# EAGLE design perfboard (EAGLE 7.3.0)
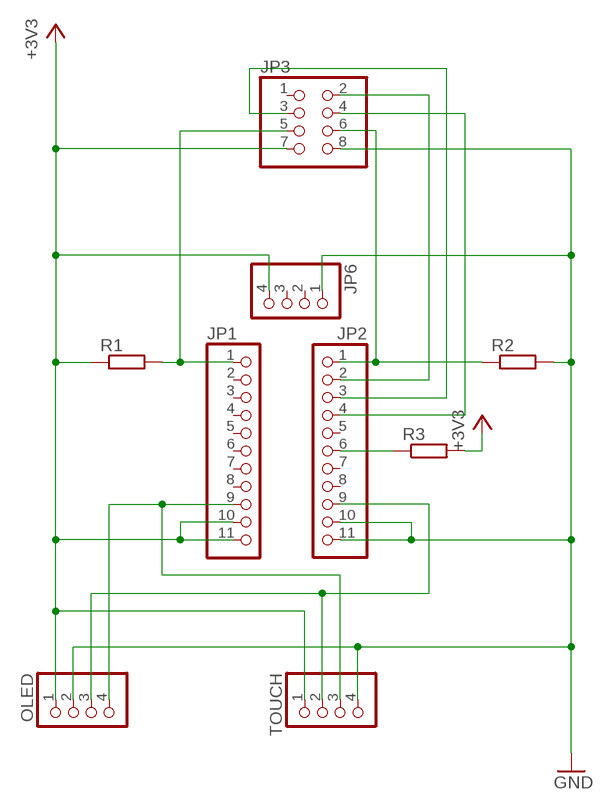
[diagram p0: schematic, sheet 1]

## Parts
JP1  PINHD-1X11  [1X11]
JP2  PINHD-1X11  [1X11]
JP3  PINHD-2X4  [2X04]
JP6  PINHD-1X4  [1X04]
OLED  PINHD-1X4  [1X04]
R1  R-EU_0207/7  [0207/7]
R2  R-EU_0207/7  [0207/7]
R3  R-EU_0207/7  [0207/7]
TOUCH  PINHD-1X4  [1X04]

## Nets
+3V3: JP1.10 JP1.11 JP3.7 JP6.4 OLED.1 R1.1 R3.2 TOUCH.1
GND: JP2.10 JP2.11 JP3.8 JP6.1 OLED.2 R2.2 TOUCH.4
N$1: JP2.2 JP3.2
N$2: JP2.3 JP3.3
N$3: JP2.4 JP3.4
N$4: JP1.1 JP3.5 R1.2
N$5: JP1.9 OLED.4 TOUCH.3
N$6: JP2.9 OLED.3 TOUCH.2
N$7: JP2.6 R3.1
N$8: JP2.1 JP3.6 R2.1
Unconnected: JP1.2 JP1.3 JP1.4 JP1.5 JP1.6 JP1.7 JP1.8 JP2.5 JP2.7 JP2.8 JP3.1 JP6.2 JP6.3

## Library data of the parts
JP1 JP2 = pinhead:PINHD-1X11: PIN HEADER
JP3 = pinhead:PINHD-2X4: PIN HEADER
JP6 OLED TOUCH = pinhead:PINHD-1X4: PIN HEADER
R1-R3 = rcl:R-EU_: RESISTOR, European symbol

## Board
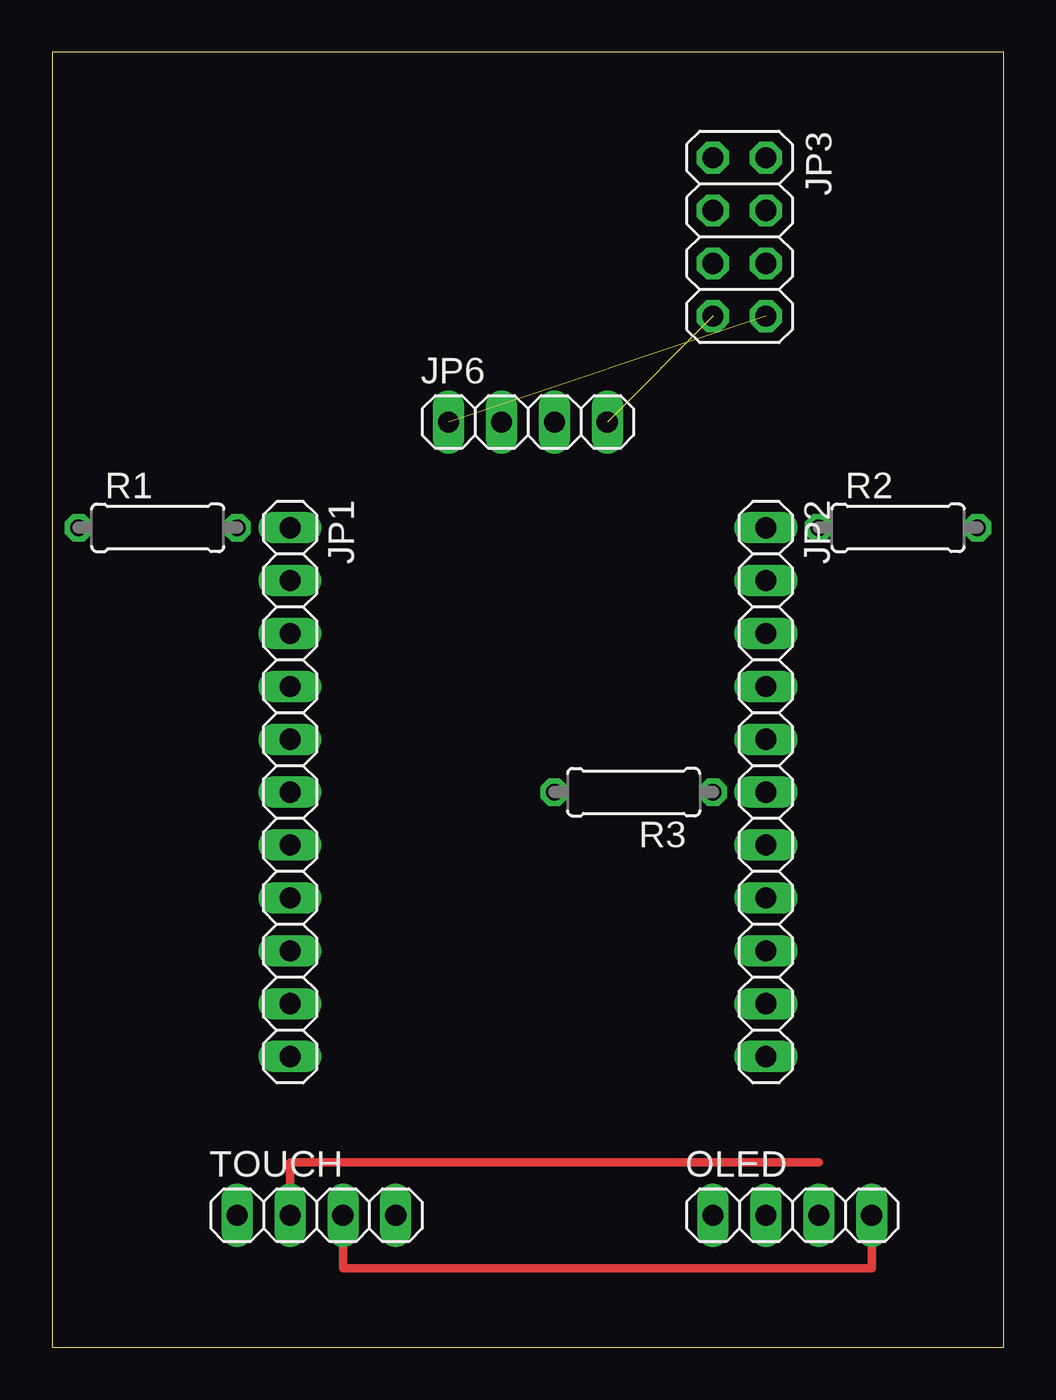
[diagram p1: board, top side]
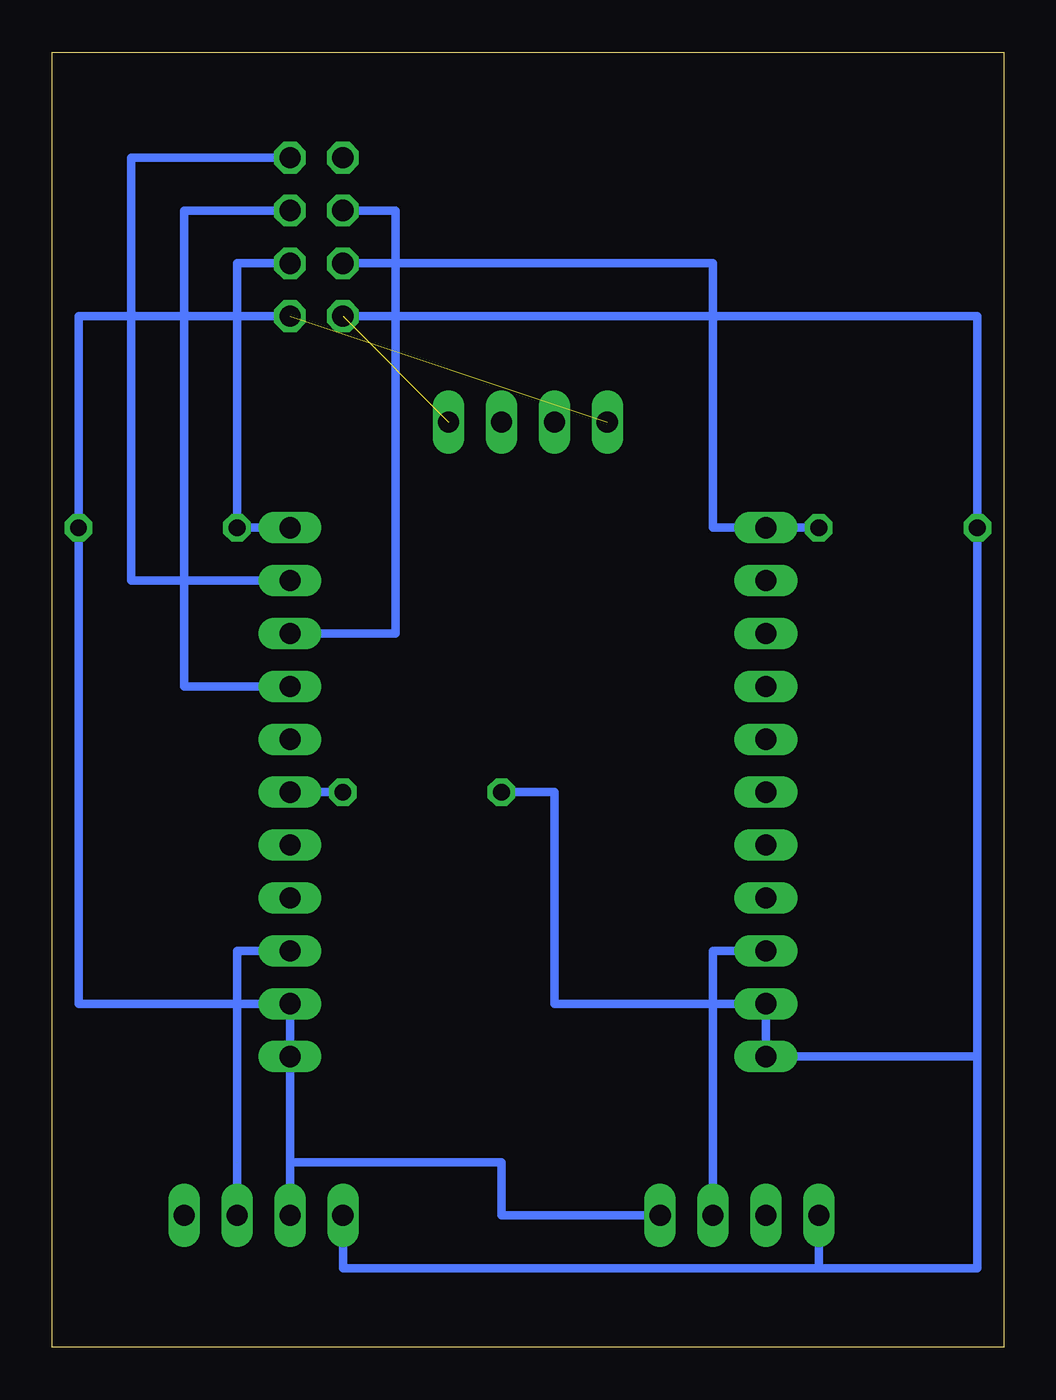
[diagram p2: board, bottom side, seen from below]

Size 45.72 x 62.22 mm. Coordinates in mm from the lower left corner, seen from the top.
Outline: 0,0 45.72,0 45.72,62.22 0,62.22 0,0
Copper layers (1*16): Top 0.035mm / dielectric 1.5mm / Bottom 0.035mm
Design rules "default": minimum track width 10mil, minimum drill 24mil, track to track 8mil, track to pad 8mil, pad to pad 8mil, via to via 8mil, smd to smd 8mil, copper to edge 40mil, drill to drill 8mil, minimum pad ring 10mil, minimum via ring 8mil, stop-mask expansion 4mil, vias tented up to drill 0mil, thermal gap 10mil

### Footprints (pad centres in the part's own frame; a part is rotated, then mirrored left to right if it is on the bottom)
1X11 = drill 1.016 long: 1 -12.7,0; 2 -10.16,0; 3 -7.62,0; 4 -5.08,0; 5 -2.54,0; 6 0,0; 7 2.54,0; 8 5.08,0; 9 7.62,0; 10 10.16,0; 11 12.7,0
2X04 = drill 1.016 octagon: 1 -3.81,-1.27; 2 -3.81,1.27; 3 -1.27,-1.27; 4 -1.27,1.27; 5 1.27,-1.27; 6 1.27,1.27; 7 3.81,-1.27; 8 3.81,1.27
1X04 = drill 1.016 long: 1 -3.81,0; 2 -1.27,0; 3 1.27,0; 4 3.81,0
0207/7 = drill 0.813 octagon: 1 -3.81,0; 2 3.81,0

### Placement (x,y rotation side)
JP1  11.43,26.67 270 top
JP2  34.29,26.67 270 top
JP3  33.02,53.34 270 top
JP6  22.86,44.45 0 top
OLED  35.56,6.35 0 top
R1  5.08,39.37 0 top
R2  40.64,39.37 0 top
R3  27.94,26.67 180 top
TOUCH  12.7,6.35 0 top

### Tracks (layer width: path | path; a pad name or v marks a point on that pad's centre or on a via)
+3V3  (1 unrouted)
  Bottom 0.406: JP3.7 1.27,49.53 R1.1 1.27,13.97 | 1.27,13.97 JP1.11 JP1.10 21.59,16.51 21.59,26.67 R3.2 | OLED.1 31.75,3.81 8.89,3.81 | 8.89,3.81 1.27,3.81 1.27,13.97 | TOUCH.1 8.89,3.81
GND  (1 unrouted)
  Bottom 0.406: JP3.8 44.45,49.53 R2.2 44.45,16.51 JP2.10 JP2.11 34.29,8.89 | OLED.2 34.29,8.89 | TOUCH.4 24.13,6.35 24.13,8.89 34.29,8.89
N$1
  Bottom 0.406: JP3.2 41.91,57.15 41.91,36.83 JP2.2
N$2
  Bottom 0.406: JP3.3 29.21,54.61 29.21,34.29 JP2.3
N$3
  Bottom 0.406: JP3.4 39.37,54.61 39.37,31.75 JP2.4
N$4
  Bottom 0.406: R1.2 JP1.1 13.97,39.37 13.97,52.07 JP3.5
N$5
  Top 0.406: OLED.4 39.37,3.81 13.97,3.81 TOUCH.3
  Bottom 0.406: TOUCH.3 13.97,19.05 JP1.9
N$6  (1 unrouted)
  Top 0.406: TOUCH.2 11.43,8.89 36.83,8.89
  Bottom 0.406: OLED.3 36.83,19.05 JP2.9
N$7
  Bottom 0.406: R3.1 JP2.6
N$8
  Bottom 0.406: JP2.1 R2.1 36.83,52.07 JP3.6